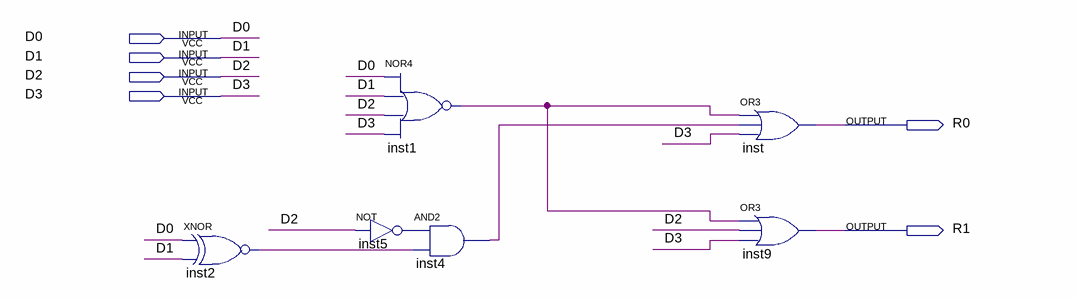
[diagram p0: schematic sheet]
// Quartus schematic FDD_TIME_ENC.bdf as structural Verilog: 6 symbols, 6 pins
module FDD_TIME_ENC (
  input  D0,
  input  D1,
  input  D2,
  input  D3,
  output R0,
  output R1
);

  wire inst1_out, inst2_out, inst4_out, inst5_out;

  xnor inst2 (inst2_out, D0, D1);
  nor inst1 (inst1_out, D0, D1, D2, D3);
  not inst5 (inst5_out, D2);
  and inst4 (inst4_out, inst5_out, inst2_out);
  or inst (R0, inst1_out, inst4_out, D3);
  or inst9 (R1, inst1_out, D2, D3);
endmodule
